# EAGLE schematic 1 energy dist (EAGLE 6.6.0)
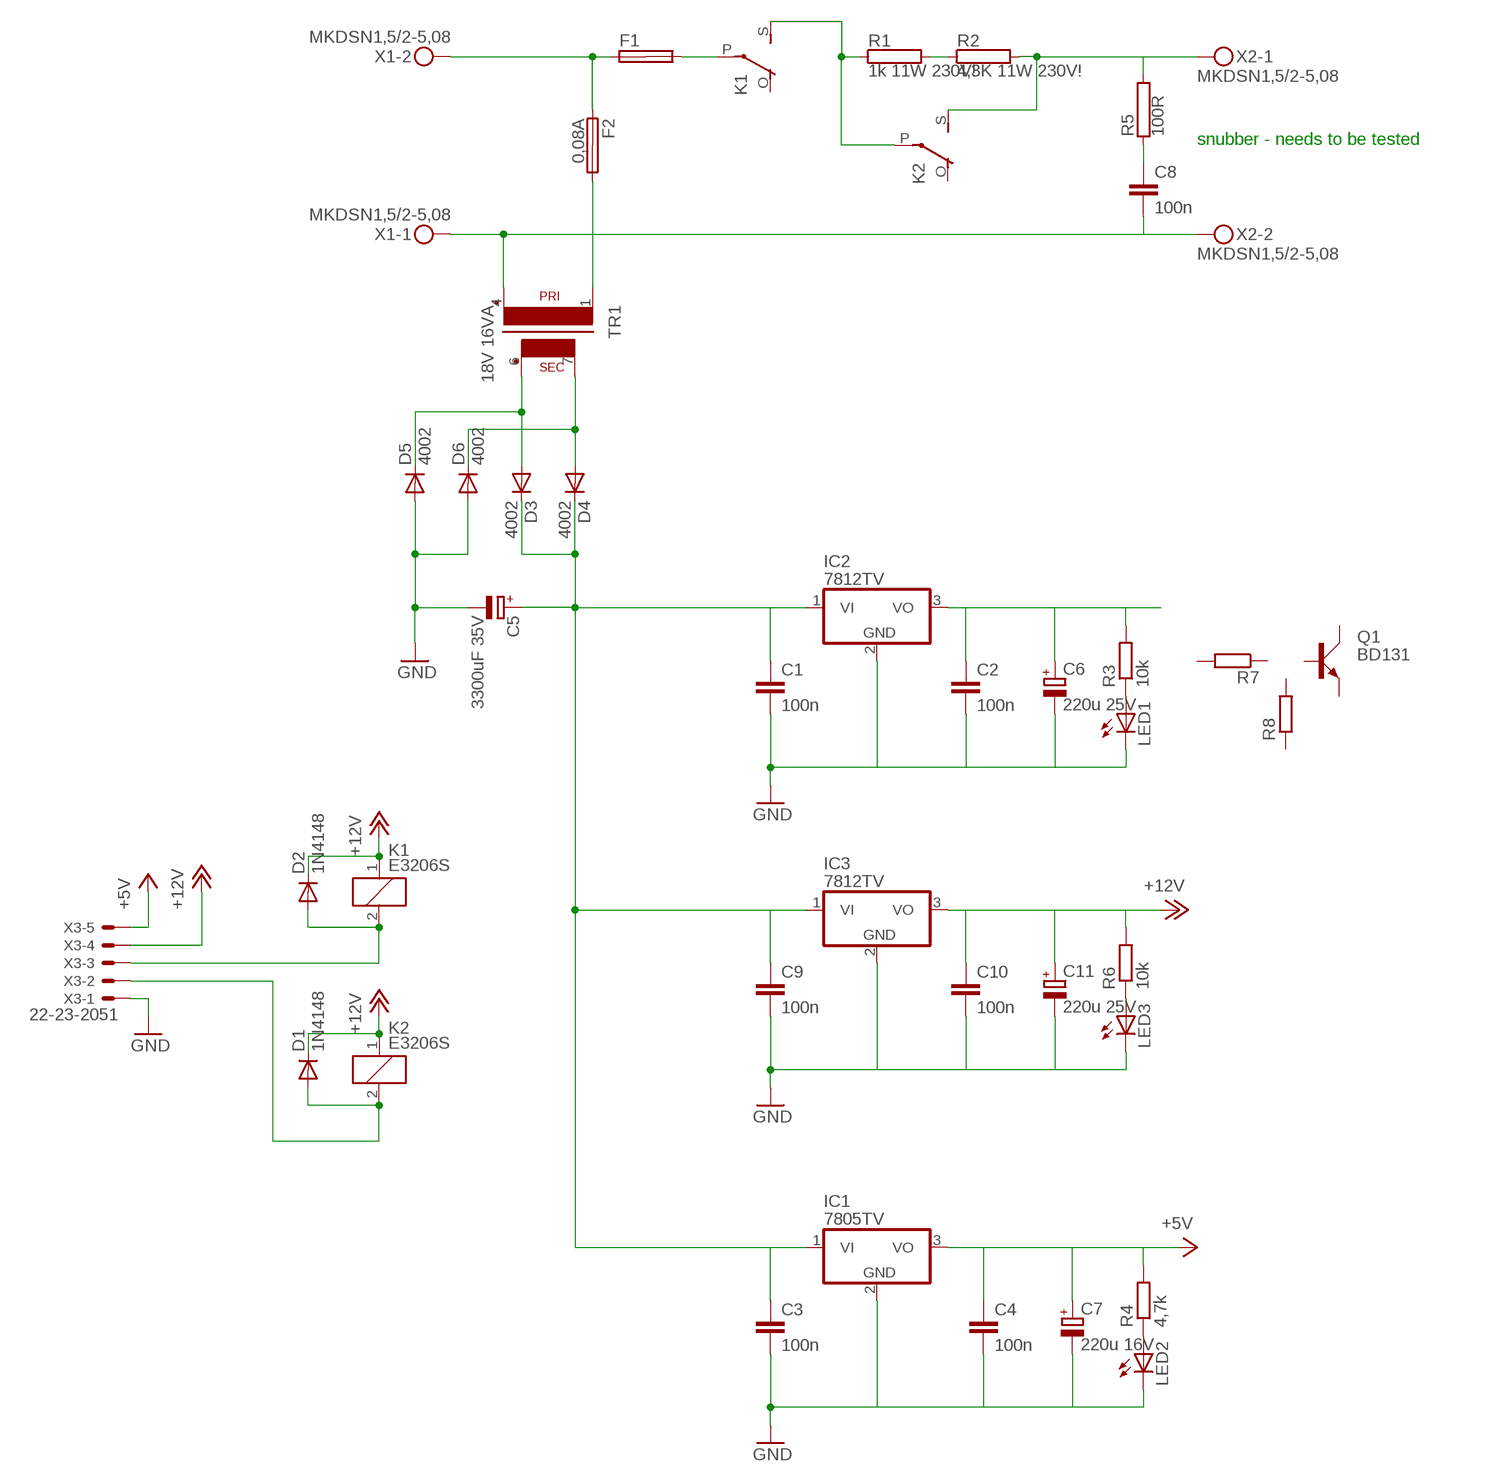
[diagram p0: schematic, sheet 1]

## Parts
C1  100n  C-EUC1206  [C1206]
C2  100n  C-EUC1206  [C1206]
C3  100n  C-EUC1206  [C1206]
C4  100n  C-EUC1206  [C1206]
C5  3300uF 35V  CPOL-EUE7.5-16  [E7,5-16]
C6  220u 25V  CPOL-EUE7.5-16  [E7,5-16]
C7  220u 16V  CPOL-EUE7.5-16  [E7,5-16]
C8  100n  C-EU275-154X316  [C275-154X316]
C9  100n  C-EUC1206  [C1206]
C10  100n  C-EUC1206  [C1206]
C11  220u 25V  CPOL-EUE7.5-16  [E7,5-16]
D1  1N4148  DIODE-MELF-MLL41  [MELF-MLL41]
D2  1N4148  DIODE-MELF-MLL41  [MELF-MLL41]
D3  4002  CGRM4002-G  [SOD-123_MINI-SMA]
D4  4002  CGRM4002-G  [SOD-123_MINI-SMA]
D5  4002  CGRM4002-G  [SOD-123_MINI-SMA]
D6  4002  CGRM4002-G  [SOD-123_MINI-SMA]
F1  SH32  [SH32]
F2  0,08A  SH32  [SH32]
IC1  7805TV  [TO220V]
IC2  7812TV  [TO220V]
IC3  7812TV  [TO220V]
K1  E3206S  [E3206S]
K2  E3206S  [E3206S]
LED1  LEDCHIPLED_1206  [CHIPLED_1206]
LED2  LEDCHIPLED_1206  [CHIPLED_1206]
LED3  LEDCHIPLED_1206  [CHIPLED_1206]
Q1  BD131  BD139  [TO126AV]
R1  1k 11W 230V!  RKH216-8  [KH216-8]
R2  4,3K 11W 230V!  RKH216-8  [KH216-8]
R3  10k  R-EU_M1206  [M1206]
R4  4,7k  R-EU_M1206  [M1206]
R5  100R  RCA0001  [CA0001]
R6  10k  R-EU_M1206  [M1206]
R7  R-EU_M1206  [M1206]
R8  R-EU_M1206  [M1206]
TR1  18V 16VA  EE20-1  [EE20-1]
X1  MKDSN1,5/2-5,08  [MKDSN1,5/2-5,08]
X2  MKDSN1,5/2-5,08  [MKDSN1,5/2-5,08]
X3  22-23-2051  [22-23-2051]

## Nets
+5V: C4.1 C7.+ IC1.3(VO) R4.2 X3.5
+12V: C10.1 C11.+ D1.C D2.C IC3.3(VO) K1.1 K2.1 R6.2 X3.4
GND: C1.2 C2.2 C3.2 C4.2 C5.- C6.- C7.- C9.2 C10.2 C11.- D5.A D6.A IC1.2(GND) IC2.2(GND) IC3.2(GND) LED1.C LED2.C LED3.C X3.1
N$1: K1.S(2:S) K2.P(2:P) R1.1
N$2: R1.2 R2.1
N$3: K2.S(2:S) R2.2 R5.2 X2.1
N$4: F1.2A K1.P(2:P)
N$5: F1.1A F2.1A X1.2
N$6: C8.2 TR1.4(P2) X1.1 X2.2
N$7: F2.2A TR1.1
N$8: D4.A D6.C TR1.7(S4)
N$9: D3.A D5.C TR1.6(S3)
N$10: C1.1 C3.1 C5.+ C9.1 D3.C D4.C IC1.1(VI) IC2.1(VI) IC3.1(VI)
N$11: LED1.A R3.1
N$12: LED2.A R4.1
N$13: D2.A K1.2 X3.3
N$14: D1.A K2.2 X3.2
N$15: C8.1 R5.1
N$17: LED3.A R6.1
N$18: C2.1 C6.+ IC2.3(VO) R3.2
Unconnected: F1.1B F1.2B F2.1B F2.2B K1.O(2:O) K2.O(2:O) Q1.B Q1.C Q1.E R7.1 R7.2 R8.1 R8.2

## Notes on the sheet
- snubber - needs to be tested

## Library data of the parts
C1-C4 C8-C10 = resistor:C-EU: CAPACITOR, European symbol
C5-C7 C11 = resistor:CPOL-EU: POLARIZED CAPACITOR, European symbol
D1 D2 = diode:DIODE-: DIODE
D3-D6 = diode:CGRM400*-G: Molded plasitc,JEDEC SOD-123/Mini SMA Source: Comchip CGRM4001-G.pdf
F1 F2 = fuse:SH32: FUSE HOLDER 6 x 32 mm, SH contact, SHH3N Schukat, 102071 Wickmann (Buerklin); MPN: 10207101009; OC_FARNELL: 811786; OC_NEWARK: 76R6904
IC1-IC3 = linear:78*: Positive VOLTAGE REGULATOR Source: http://cache.national.com/ds/LM/LM78L05.pdf http://www.fairchildsemi.com/ds/LM/LM7805.pdf
K1 K2 = relay:E3206S: RELAY 1 x switch, Eichhoff/distributor Schukat; OC_FARNELL: unknown; OC_NEWARK: unknown
LED1-LED3 = led:LED: LED OSRAM: - CHIPLED LG R971, LG N971, LY N971, LG Q971, LY Q971, LO R971, LY R971 LH N974, LH R974 LS Q976, LO Q976, LY Q976 LO Q996 - Hyper CHIPLED LW Q18S LB Q993, LB Q99A, LB R99A - SideLED LS A670, LO A670, LY A670, LG A670, LP A670 LB A673, LV A673, LT A673, LW A673 LH A674 LY A675 LS A676, LA A676, LO A676, LY A676, LW A676 LS A679, LY A679, LG A679 - Hyper Micro SIDELED® LS Y876, LA Y876, LO Y876, LY Y876 LT Y87S - SmartLED LW L88C, LW L88S LB L89C, LB L89S, LG L890 LS L89K, LO L89K, LY L89K LS L896, LA L896, LO L896, LY L896 - TOPLED LS T670, LO T670, LY T670, LG T670, LP T670 LSG T670, LSP T670, LSY T670, LOP T670, LYG T670 LG T671, LOG T671, LSG T671 LB T673, LV T673, LT T673, LW T673 LH T674 LS T676, LA T676, LO T676, LY T676, LB T676, LH T676, LSB T676, LW T676 LB T67C, LV T67C, LT T67C, LS T67K, LO T67K, LY T67K, LW E67C LS E67B, LA E67B, LO E67B, LY E67B, LB E67C, LV E67C, LT E67C LW T67C LS T679, LY T679, LG T679 LS T770, LO T770, LY T770, LG T770, LP T770 LB T773, LV T773, LT T773, LW T773 LH T774 LS E675, LA E675, LY E675, LS T675 LS T776, LA T776, LO T776, LY T776, LB T776 LHGB T686 LT T68C, LB T68C - Hyper Mini TOPLED® LB M676 - Mini TOPLED Santana® LG M470 LS M47K, LO M47K, LY M47K Source: http://www.osram.convergy.de LUXEON: - LUMILED® LXK2-PW12-R00, LXK2-PW12-S00, LXK2-PW14-U00, LXK2-PW14-V00 LXK2-PM12-R00, LXK2-PM12-S00, LXK2-PM14-U00 LXK2-PE12-Q00, LXK2-PE12-R00, LXK2-PE12-S00, LXK2-PE14-T00, LXK2-PE14-U00 LXK2-PB12-K00, LXK2-PB12-L00, LXK2-PB12-M00, LXK2-PB14-N00, LXK2-PB14-P00, LXK2-PB14-Q00 LXK2-PR12-L00, LXK2-PR12-M00, LXK2-PR14-Q00, LXK2-PR14-R00 LXK2-PD12-Q00, LXK2-PD12-R00, LXK2-PD12-S00 LXK2-PH12-R00, LXK2-PH12-S00 LXK2-PL12-P00, LXK2-PL12-Q00, LXK2-PL12-R00 Source: www.luxeon.com KINGBRIGHT: KA-3528ASYC Source: www.kingbright.com
Q1 = transistor-power:BD139: NPN TRANSISTOR
R1 R2 R5 = resistor-power:R: Power Resitor; OC_FARNELL: unknown; OC_NEWARK: unknown
R3 R4 R6-R8 = resistor:R-EU_: RESISTOR, European symbol
TR1 = trafo:EE20-1: TRANSFORMER 1 primary winding, 1 secondary winding ERA
X1 X2 = con-phoenix-508:MKDSN1,5/2-5,08: MKDSN 1,5/ 2-5,08 Printklemme Nennstrom: 13,5 A Nennspannung: 250 V Rastermaß: 5,08 mm Polzahl: 2 Anschlussart: Schraubanschluss Montage: Löten Anschlussrichtung Leiter/Platine: 0 ° Artikelnummer: 1729128 Source: http://eshop.phoenixcontact.com .. 1729128.pdf
X3 = con-molex:22-23-2051: .100" (2.54mm) Center Header - 5 Pin; MF: MOLEX; MPN: 22-23-2051; OC_FARNELL: 1462952; OC_NEWARK: 38C9178